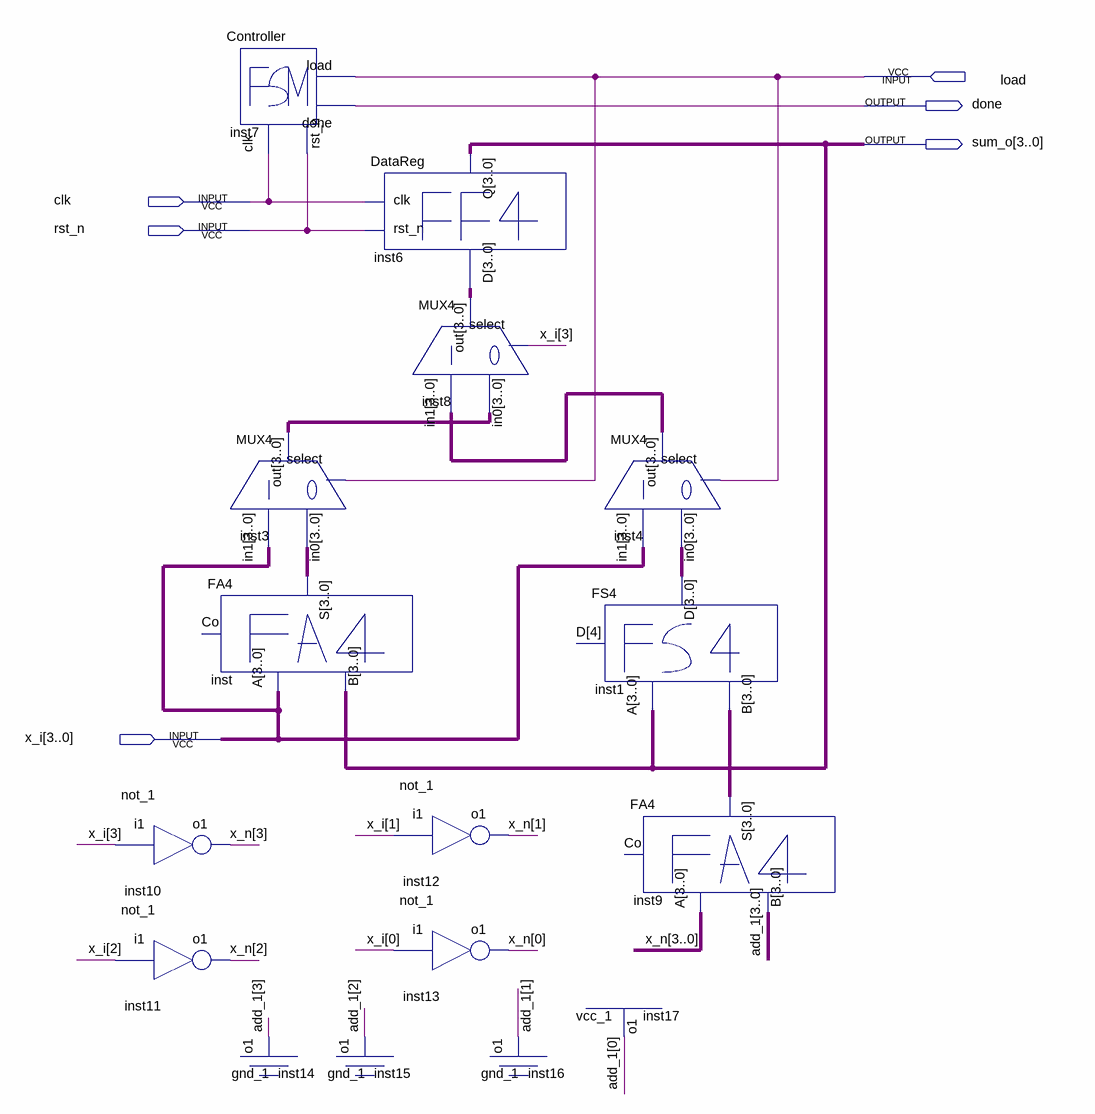
[diagram p0: schematic sheet]
// Quartus schematic AC4.bdf as structural Verilog: 16 symbols, 6 pins
module AC4 (
  input  load,
  input  clk,
  input  rst_n,
  input  [3:0] x_i,
  output done,
  output [3:0] sum_o
);

  wire [3:0] add_1, inst1_d, inst3_out, inst4_out, inst8_out, inst9_s, inst_s, x_n;
  wire [4:0] inst1_d_open;  // unused outputs

  not_1 inst10 (.i1(x_i[3]), .o1(x_n[3]));
  not_1 inst11 (.i1(x_i[2]), .o1(x_n[2]));
  Controller inst7 (.load(load), .clk(clk), .rst_n(rst_n), .done(done));
  FA4 inst (.A(x_i), .B(sum_o), .S(inst_s));  // open: Co
  MUX4 inst3 (.in1(x_i), .in0(inst_s), .select(load), .out(inst3_out));
  gnd_1 inst14 (.o1(add_1[3]));
  DataReg inst6 (.clk(clk), .rst_n(rst_n), .D(inst8_out), .Q(sum_o));
  gnd_1 inst15 (.o1(add_1[2]));
  MUX4 inst8 (.in1(inst4_out), .in0(inst3_out), .select(x_i[3]), .out(inst8_out));
  not_1 inst12 (.i1(x_i[1]), .o1(x_n[1]));
  not_1 inst13 (.i1(x_i[0]), .o1(x_n[0]));
  gnd_1 inst16 (.o1(add_1[1]));
  MUX4 inst4 (.in1(x_i), .in0(inst1_d), .select(load), .out(inst4_out));
  FS4 inst1 (.B(inst9_s), .A(sum_o), .D({inst1_d_open[4], inst1_d}));
  vcc_1 inst17 (.o1(add_1[0]));
  FA4 inst9 (.A(x_n), .B(add_1), .S(inst9_s));  // open: Co
endmodule
